# Altium schematic sheet Arduino_Pro mini.SchDoc
size 381 x 241 mm; SheetNumber: 1; SheetTotal: 1
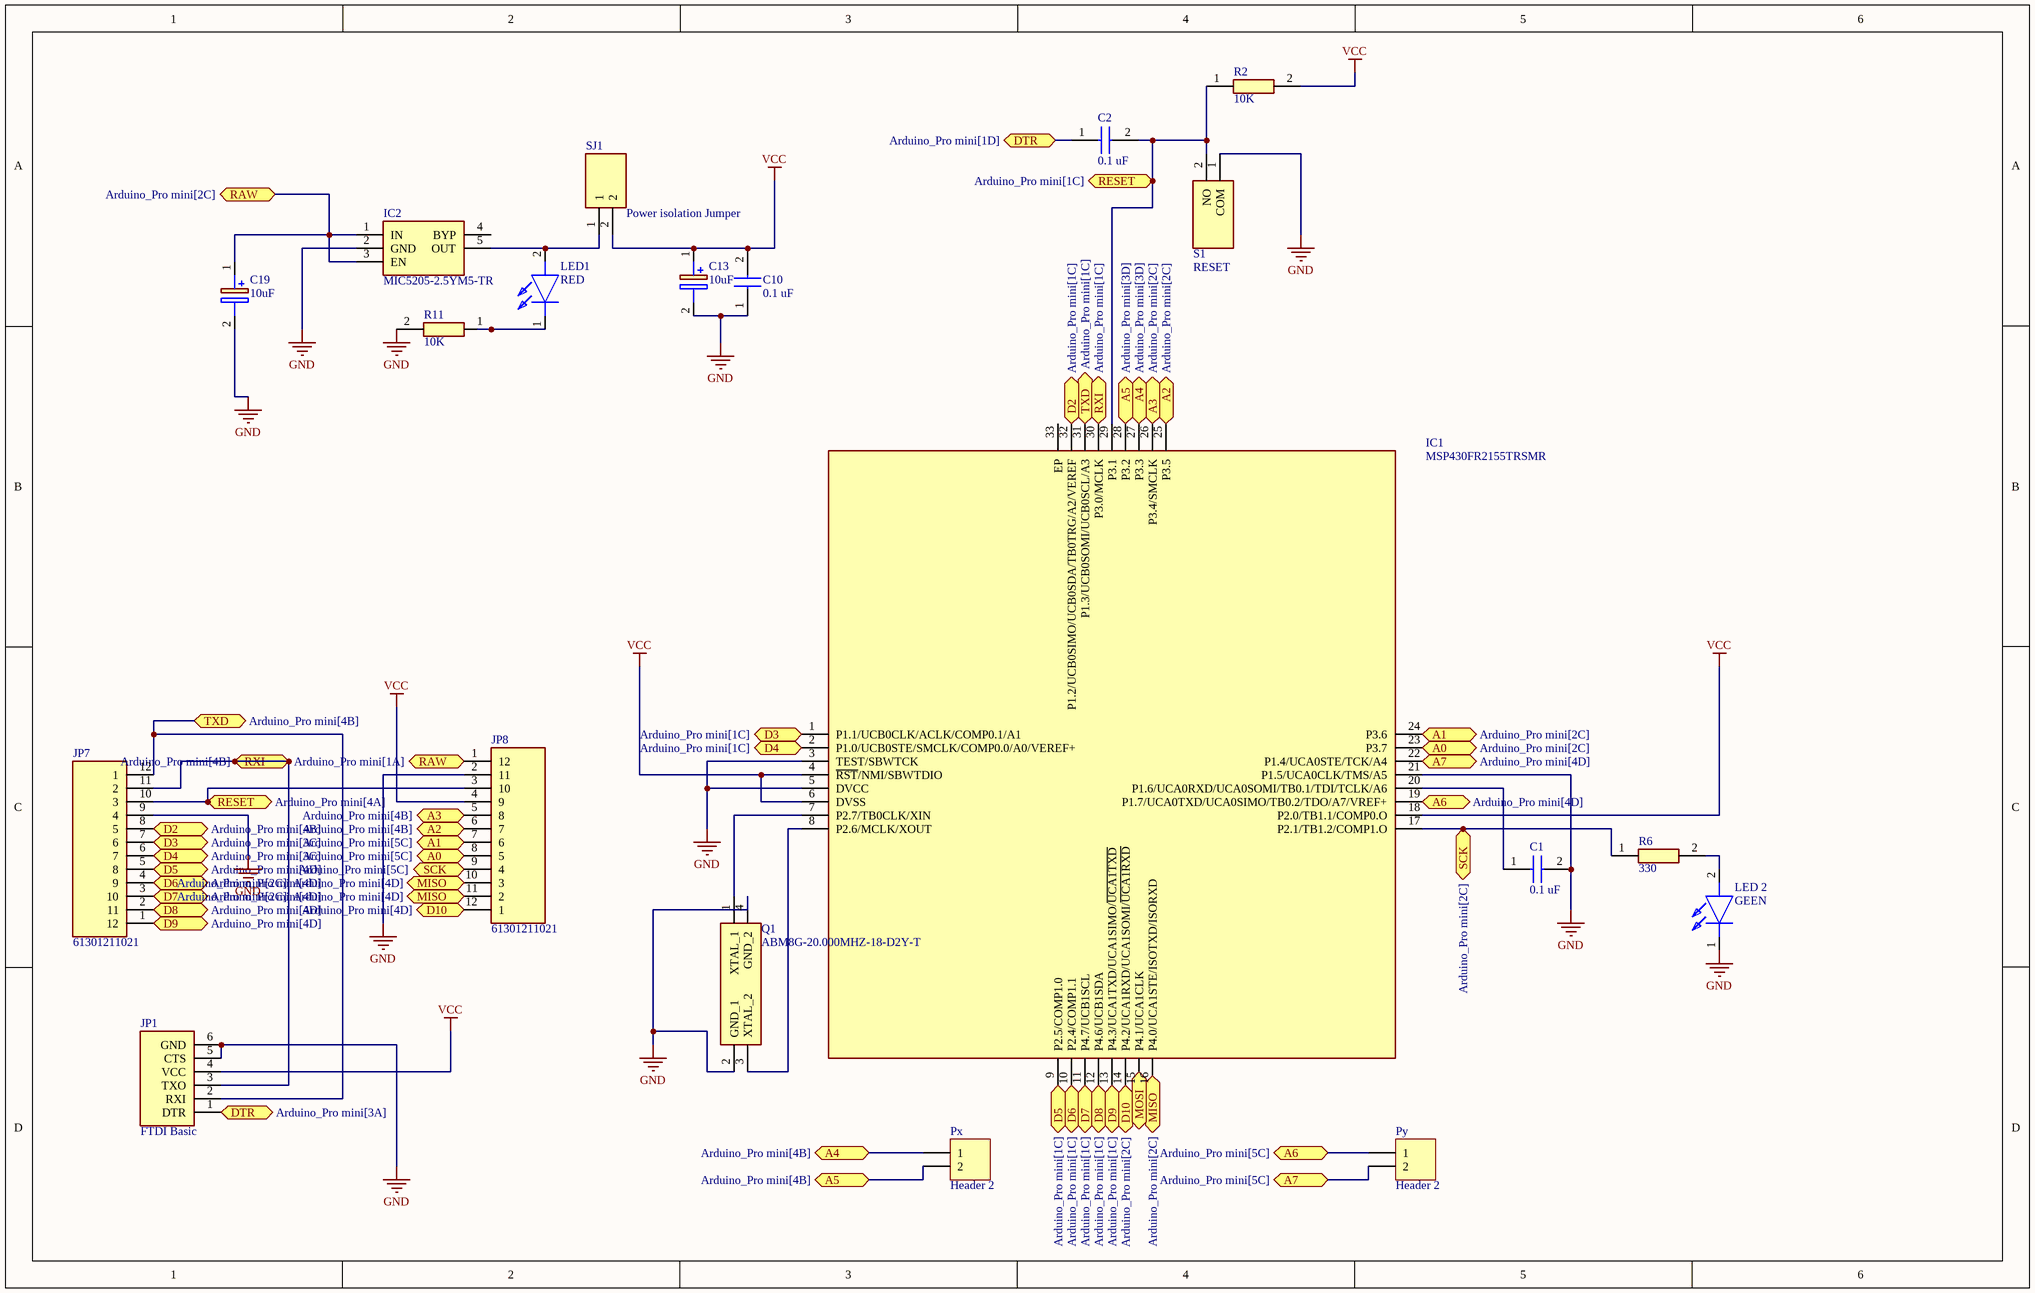
[diagram p0: Arduino_Pro mini.SchDoc]

## Parts
C1  0.1 uF  [CAPC1608X95N]
C2  0.1 uF  [CAPC1608X95N]
C10  0.1 uF  [CAPC1608X95N]
C13  10uF  [T491A]
C19  10uF  [T491A]
IC1  MSP430FR2155TRSMR  [QFN40P400X400X100-33N-D]
IC2  MIC5205-2.5YM5-TR  [SOT95P280X145-5N]
JP1  FTDI Basic  [HDRV6W66P0X254_1X6_1524X249X838P]
JP7  61301211021  [HDRRA12W64P0X254_1X12_3048X254X254P]
JP8  61301211021  [HDRRA12W64P0X254_1X12_3048X254X254P]
LED1  RED  [LEDC3015X150N]
LED_2  GEEN  [LEDC1608X65N]
Px  Header 2  [HDR1X2]
Py  Header 2  [HDR1X2]
Q1  ABM8G-20.000MHZ-18-D2Y-T  [ABM8G]
R2  10K  [RESC1608X55N]
R6  330  [RESC2013X65N]
R11  10K  [RESC1608X55N]
S1  RESET  [KSR211GLFS]
SJ1  Power isolation Jumper  [HDRV2W64P0X254_1X2_508X254X838P]

## Ports
A0 (bidir, see Arduino_Pro mini[2C]), A0 (bidir, see Arduino_Pro mini[5C]), A1 (bidir, see Arduino_Pro mini[2C]), A1 (bidir, see Arduino_Pro mini[5C]), A2 (bidir, see Arduino_Pro mini[2C]), A2 (bidir, see Arduino_Pro mini[4B]), A3 (bidir, see Arduino_Pro mini[2C]), A3 (bidir, see Arduino_Pro mini[4B]), A4 (bidir, see Arduino_Pro mini[3D]), A4 (bidir, see Arduino_Pro mini[4B]), A5 (bidir, see Arduino_Pro mini[3D]), A5 (bidir, see Arduino_Pro mini[4B]), A6 (bidir, see Arduino_Pro mini[4D]), A6 (bidir, see Arduino_Pro mini[5C]), A7 (bidir, see Arduino_Pro mini[4D]), A7 (bidir, see Arduino_Pro mini[5C]), D2 (bidir, see Arduino_Pro mini[1C]), D2 (bidir, see Arduino_Pro mini[4B]), D3 (bidir, see Arduino_Pro mini[1C]), D3 (bidir, see Arduino_Pro mini[3C]), D4 (bidir, see Arduino_Pro mini[1C]), D4 (bidir, see Arduino_Pro mini[3C]), D5 (bidir, see Arduino_Pro mini[1C]), D5 (bidir, see Arduino_Pro mini[4D]), D6 (bidir, see Arduino_Pro mini[1C]), D6 (bidir, see Arduino_Pro mini[4D]), D7 (bidir, see Arduino_Pro mini[1C]), D7 (bidir, see Arduino_Pro mini[4D]), D8 (bidir, see Arduino_Pro mini[1C]), D8 (bidir, see Arduino_Pro mini[4D]), D9 (bidir, see Arduino_Pro mini[1C]), D9 (bidir, see Arduino_Pro mini[4D]), D10 (bidir, see Arduino_Pro mini[2C]), D10 (bidir, see Arduino_Pro mini[4D]), DTR (bidir, see Arduino_Pro mini[1D]), DTR (bidir, see Arduino_Pro mini[3A]), MISO (bidir, see Arduino_Pro mini[2C]), MISO (bidir, see Arduino_Pro mini[2C], Arduino_Pro mini[4D]), MOSI (bidir), RAW (bidir, see Arduino_Pro mini[1A]), RAW (bidir, see Arduino_Pro mini[2C]), RESET (bidir, see Arduino_Pro mini[1C]), RESET (bidir, see Arduino_Pro mini[4A]), RXI (bidir, see Arduino_Pro mini[1C]), RXI (bidir, see Arduino_Pro mini[4B]), SCK (bidir, see Arduino_Pro mini[2C]), SCK (bidir, see Arduino_Pro mini[5C]), TXD (bidir, see Arduino_Pro mini[1C]), TXD (bidir, see Arduino_Pro mini[4B])

## Nets
GND: C1.2 C10.1 C13.2(-) C19.2(-) IC1.3(TEST/SBWTCK) IC1.5(DVCC) IC1.21(P1.5/UCA0CLK/TMS/A5) IC2.2(GND) JP1.5(CTS) JP1.6(GND) JP7.9(4) JP8.2(11) LED_2.1(K) Q1.2(GND_1) Q1.4(GND_2) R11.2 S1.1(COM)
VCC: C10.2 C13.1(+) IC1.4(~{RST}/NMI/SBWTDIO) IC1.6(DVSS) IC1.18(P2.0/TB1.1/COMP0.O) JP1.4(VCC) JP8.4(9) R2.2 SJ1.2
A0: IC1.23(P3.7) JP8.8(5) ; port A0
A1: IC1.24(P3.6) JP8.7(6) ; port A1
A2: IC1.25(P3.5) JP8.6(7) ; port A2
A3: IC1.26(P3.4/SMCLK) JP8.5(8) ; port A3
A4: IC1.27(P3.3) Px.1 ; port A4
A5: IC1.28(P3.2) Px.2 ; port A5
A6: IC1.19(P1.7/UCA0TXD/UCA0SIMO/TB0.2/TDO/A7/VREF+) Py.1 ; port A6
A7: IC1.22(P1.4/UCA0STE/TCK/A4) Py.2 ; port A7
D2: IC1.32(P1.2/UCB0SIMO/UCB0SDA/TB0TRG/A2/VEREF) JP7.8(5) ; port D2
D3: IC1.1(P1.1/UCB0CLK/ACLK/COMP0.1/A1) JP7.7(6) ; port D3
D4: IC1.2(P1.0/UCB0STE/SMCLK/COMP0.0/A0/VEREF+) JP7.6(7) ; port D4
D5: IC1.9(P2.5/COMP1.0) JP7.5(8) ; port D5
D6: IC1.10(P2.4/COMP1.1) JP7.4(9) ; port D6
D7: IC1.11(P4.7/UCB1SCL) JP7.3(10) ; port D7
D8: IC1.12(P4.6/UCB1SDA) JP7.2(11) ; port D8
D9: IC1.13(P4.3/UCA1TXD/UCA1SIMO/~{UCA1TXD}) JP7.1(12) ; port D9
D10: IC1.14(P4.2/UCA1RXD/UCA1SOMI/~{UCA1RXD}) JP8.12(1) ; port D10
DTR: C2.1 JP1.1(DTR) ; port DTR
MISO: JP8.10(3) JP8.11(2) ; port MISO
RAW: C19.1(+) IC2.1(IN) IC2.3(EN) JP8.1(12) ; port RAW
RESET: C2.2 IC1.29(P3.1) JP7.10(3) JP8.3(10) R2.1 S1.2(NO) ; port RESET
RXI: IC1.30(P3.0/MCLK) JP1.3(TXO) JP7.11(2) ; port RXI
SCK: IC1.17(P2.1/TB1.2/COMP1.O) JP8.9(4) R6.1 ; port SCK
TXD: IC1.31(P1.3/UCB0SOMI/UCB0SCL/A3) JP1.2(RXI) JP7.12(1) ; port TXD
NetC1_1: C1.1 IC1.20(P1.6/UCA0RXD/UCA0SOMI/TB0.1/TDI/TCLK/A6)
NetIC1_7: IC1.7(P2.7/TB0CLK/XIN) Q1.1(XTAL_1)
NetIC1_8: IC1.8(P2.6/MCLK/XOUT) Q1.3(XTAL_2)
NetIC2_5: IC2.5(OUT) LED1.2(A) SJ1.1
NetLED1_1: LED1.1(K) R11.1
NetLED_2_2: LED_2.2(A) R6.2

Not connected (* = marked no-connect by the designer): IC1 15(P4.1/UCA1CLK) 16(P4.0/UCA1STE/ISOTXD/ISORXD) 33(EP); IC2 4(BYP)

## Library data of the parts
C1 C2 C10 = C0603C104K4RAC-TU: Capacitor; Manufacturer_Name: KEMET; Datasheet Link: https://connect.kemet.com:7667/gateway/IntelliData-ComponentDocumentation/1.0/download/specsheet/C0603C104K4RACTU; Height: 0.95mm; Manufacturer_Part_Number: C0603C104K4RAC-TU; Arrow Part Number: C0603C104K4RAC-TU; Arrow Price/Stock: https://www.arrow.com/en/products/c0603c104k4ractu/kemet-corporation
C13 C19 = T491A106K020AT: Capacitor Polarised; Manufacturer_Name: KEMET; Datasheet Link: https://content.kemet.com/datasheets/KEM_T2005_T491.pdf; Height: 1.8mm; Manufacturer_Part_Number: T491A106K020AT; Mouser Part Number: 80-T491A106K020AT; Mouser Price/Stock: https://www.mouser.co.uk/ProductDetail/KEMET/T491A106K020AT?qs=TooEEMgOWu79qKWrUr4%2FRg%3D%3D; Arrow Part Number: T491A106K020AT; Arrow Price/Stock: https://www.arrow.com/en/products/t491a106k020at/kemet-corporation
IC1 = MSP430FR2155TRSMR: Integrated Circuit; Manufacturer_Name: Texas Instruments; Datasheet Link: http://www.ti.com/lit/gpn/MSP430FR2155; Height: 1mm; Manufacturer_Part_Number: MSP430FR2155TRSMR; Mouser Part Number: 595-SP430FR2155TRSMR; Mouser Price/Stock: https://www.mouser.co.uk/ProductDetail/Texas-Instruments/MSP430FR2155TRSMR?qs=l4Gc20tDgJJ4XzVxgiAadg%3D%3D; Arrow Part Number: MSP430FR2155TRSMR; Arrow Price/Stock: https://www.arrow.com/en/products/msp430fr2155trsmr/texas-instruments
IC2 = MIC5205-2.5YM5-TR: Integrated Circuit; Manufacturer_Name: Microchip; Datasheet Link: http://www.microchip.com/mymicrochip/filehandler.aspx?ddocname=en579613; Height: 1.45mm; Manufacturer_Part_Number: MIC5205-2.5YM5-TR; Mouser Part Number: 998-MIC5205-2.5YM5TR; Mouser Price/Stock: https://www.mouser.co.uk/ProductDetail/Microchip-Technology-Atmel/MIC5205-2.5YM5-TR?qs=U6T8BxXiZAUdzSrN99Xszw%3D%3D; Arrow Part Number: MIC5205-2.5YM5-TR; Arrow Price/Stock: https://www.arrow.com/en/products/mic5205-2.5ym5-tr/microchip-technology?region=nac
JP1 = 22-28-4063: Connector; Manufacturer_Name: Molex; Datasheet Link: https://www.molex.com/pdm_docs/sd/022284063_sd.pdf; Height: 8.38mm; Manufacturer_Part_Number: 22-28-4063; Mouser Part Number: 538-22-28-4063; Mouser Price/Stock: https://www.mouser.co.uk/ProductDetail/Molex/22-28-4063?qs=MuwpYaHj750CQ%2FtWum2FiQ%3D%3D
JP7 JP8 = 61301211021: Connector; Manufacturer_Name: Wurth Elektronik; Datasheet Link: http://katalog.we-online.de/em/datasheet/6130xx11021.pdf; Height: 2.54mm; Manufacturer_Part_Number: 61301211021; Mouser Part Number: 710-61301211021; Mouser Price/Stock: https://www.mouser.co.uk/ProductDetail/Wurth-Elektronik/61301211021?qs=PhR8RmCirEaOIL3BwTB5KQ%3D%3D
LED1 = 597-3111-407F: LED; Manufacturer_Name: Dialight; Datasheet Link: https://datasheet.datasheetarchive.com/originals/distributors/Datasheets-DGA13/1153722.pdf; Height: 1.5mm; Manufacturer_Part_Number: 597-3111-407F; Mouser Part Number: 645-597-3111-407F; Mouser Price/Stock: https://www.mouser.co.uk/ProductDetail/Dialight/597-3111-407F?qs=DVhSRDYZfLqO0KXLkTIRsA%3D%3D
LED_2 = SML-D15MWT86C: LED; Manufacturer_Name: ROHM Semiconductor; Datasheet Link: https://componentsearchengine.com/Datasheets/2/SML-D15MWT86C.pdf; Height: 0.65mm; Manufacturer_Part_Number: SML-D15MWT86C; Mouser Part Number: 755-SML-D15MWT86C; Mouser Price/Stock: https://www.mouser.co.uk/ProductDetail/ROHM-Semiconductor/SML-D15MWT86C?qs=HXFqYaX1Q2wgWEaRaGz0xQ%3D%3D
Px Py = Header 2: Header, 2-Pin; LatestRevisionDate: 17-Jul-2002; LatestRevisionNote: Re-released for DXP Platform.; Publisher: Altium Limited
Q1 = ABM8G-20.000MHZ-18-D2Y-T: Crystal or Oscillator; Manufacturer_Name: ABRACON; Datasheet Link: https://abracon.com/Resonators/ABM8G.pdf; Height: 1mm; Manufacturer_Part_Number: ABM8G-20.000MHZ-18-D2Y-T; Mouser Part Number: 815-ABM8G-20-18D2Y; Mouser Price/Stock: https://www.mouser.co.uk/ProductDetail/ABRACON/ABM8G-20.000MHZ-18-D2Y-T?qs=3LVMET7lfiO7IrYuOPVToQ%3D%3D; Arrow Part Number: ABM8G-20.000MHZ-18-D2Y-T; Arrow Price/Stock: https://www.arrow.com/en/products/abm8g-20.000mhz-18-d2y-t/abracon?region=nac
R2 R11 = CRG0603J10K: Resistor; Manufacturer_Name: TE Connectivity; Datasheet Link: http://docs-europe.electrocomponents.com/webdocs/13d1/0900766b813d116f.pdf; Height: 0.55mm; Manufacturer_Part_Number: CRG0603J10K; Mouser Part Number: 279-CRG0603J10K; Mouser Price/Stock: https://www.mouser.co.uk/ProductDetail/TE-Connectivity-Holsworthy/CRG0603J10K?qs=DfH2yQaBz6tD2y0YzGh6lw%3D%3D; Arrow Part Number: CRG0603J10K; Arrow Price/Stock: https://www.arrow.com/en/products/crg0603j10k/te-connectivity?region=nac
R6 = CRGH0805F330R: Resistor; Manufacturer_Name: TE Connectivity; Datasheet Link: http://docs-europe.electrocomponents.com/webdocs/12d7/0900766b812d7379.pdf; Height: 0.65mm; Manufacturer_Part_Number: CRGH0805F330R; Mouser Part Number: 279-CRGH0805F330R; Mouser Price/Stock: https://www.mouser.co.uk/ProductDetail/TE-Connectivity-Holsworthy/CRGH0805F330R/?qs=j1jvDfvplqKfkjEPC6c0yA%3D%3D; Arrow Part Number: CRGH0805F330R; Arrow Price/Stock: https://www.arrow.com/en/products/crgh0805f330r/te-connectivity
S1 = KSR211GLFS: Switch; Manufacturer_Name: C & K COMPONENTS; Datasheet Link: https://www.ckswitches.com/media/1466/ksr.pdf; Height: 2.5mm; Manufacturer_Part_Number: KSR211GLFS; Mouser Part Number: 611-KSR211GLFS; Mouser Price/Stock: https://www.mouser.co.uk/ProductDetail/CK/KSR211GLFS?qs=vOd3edNlRKCY0q%252BhXpceRA%3D%3D; Arrow Part Number: KSR211GLFS; Arrow Price/Stock: https://www.arrow.com/en/products/ksr211glfs/ck
SJ1 = PEC02SAAN: Connector; Manufacturer_Name: Sullins; Datasheet Link: https://s3.amazonaws.com/catalogspreads-pdf/PAGE112-113%20.100%20MALE%20HDR.pdf; Height: 8.38mm; Manufacturer_Part_Number: PEC02SAAN